# Altium schematic sheet Sheet1.SchDoc (part 1 of 3)
size C; SheetNumber: 1; SheetTotal: 1
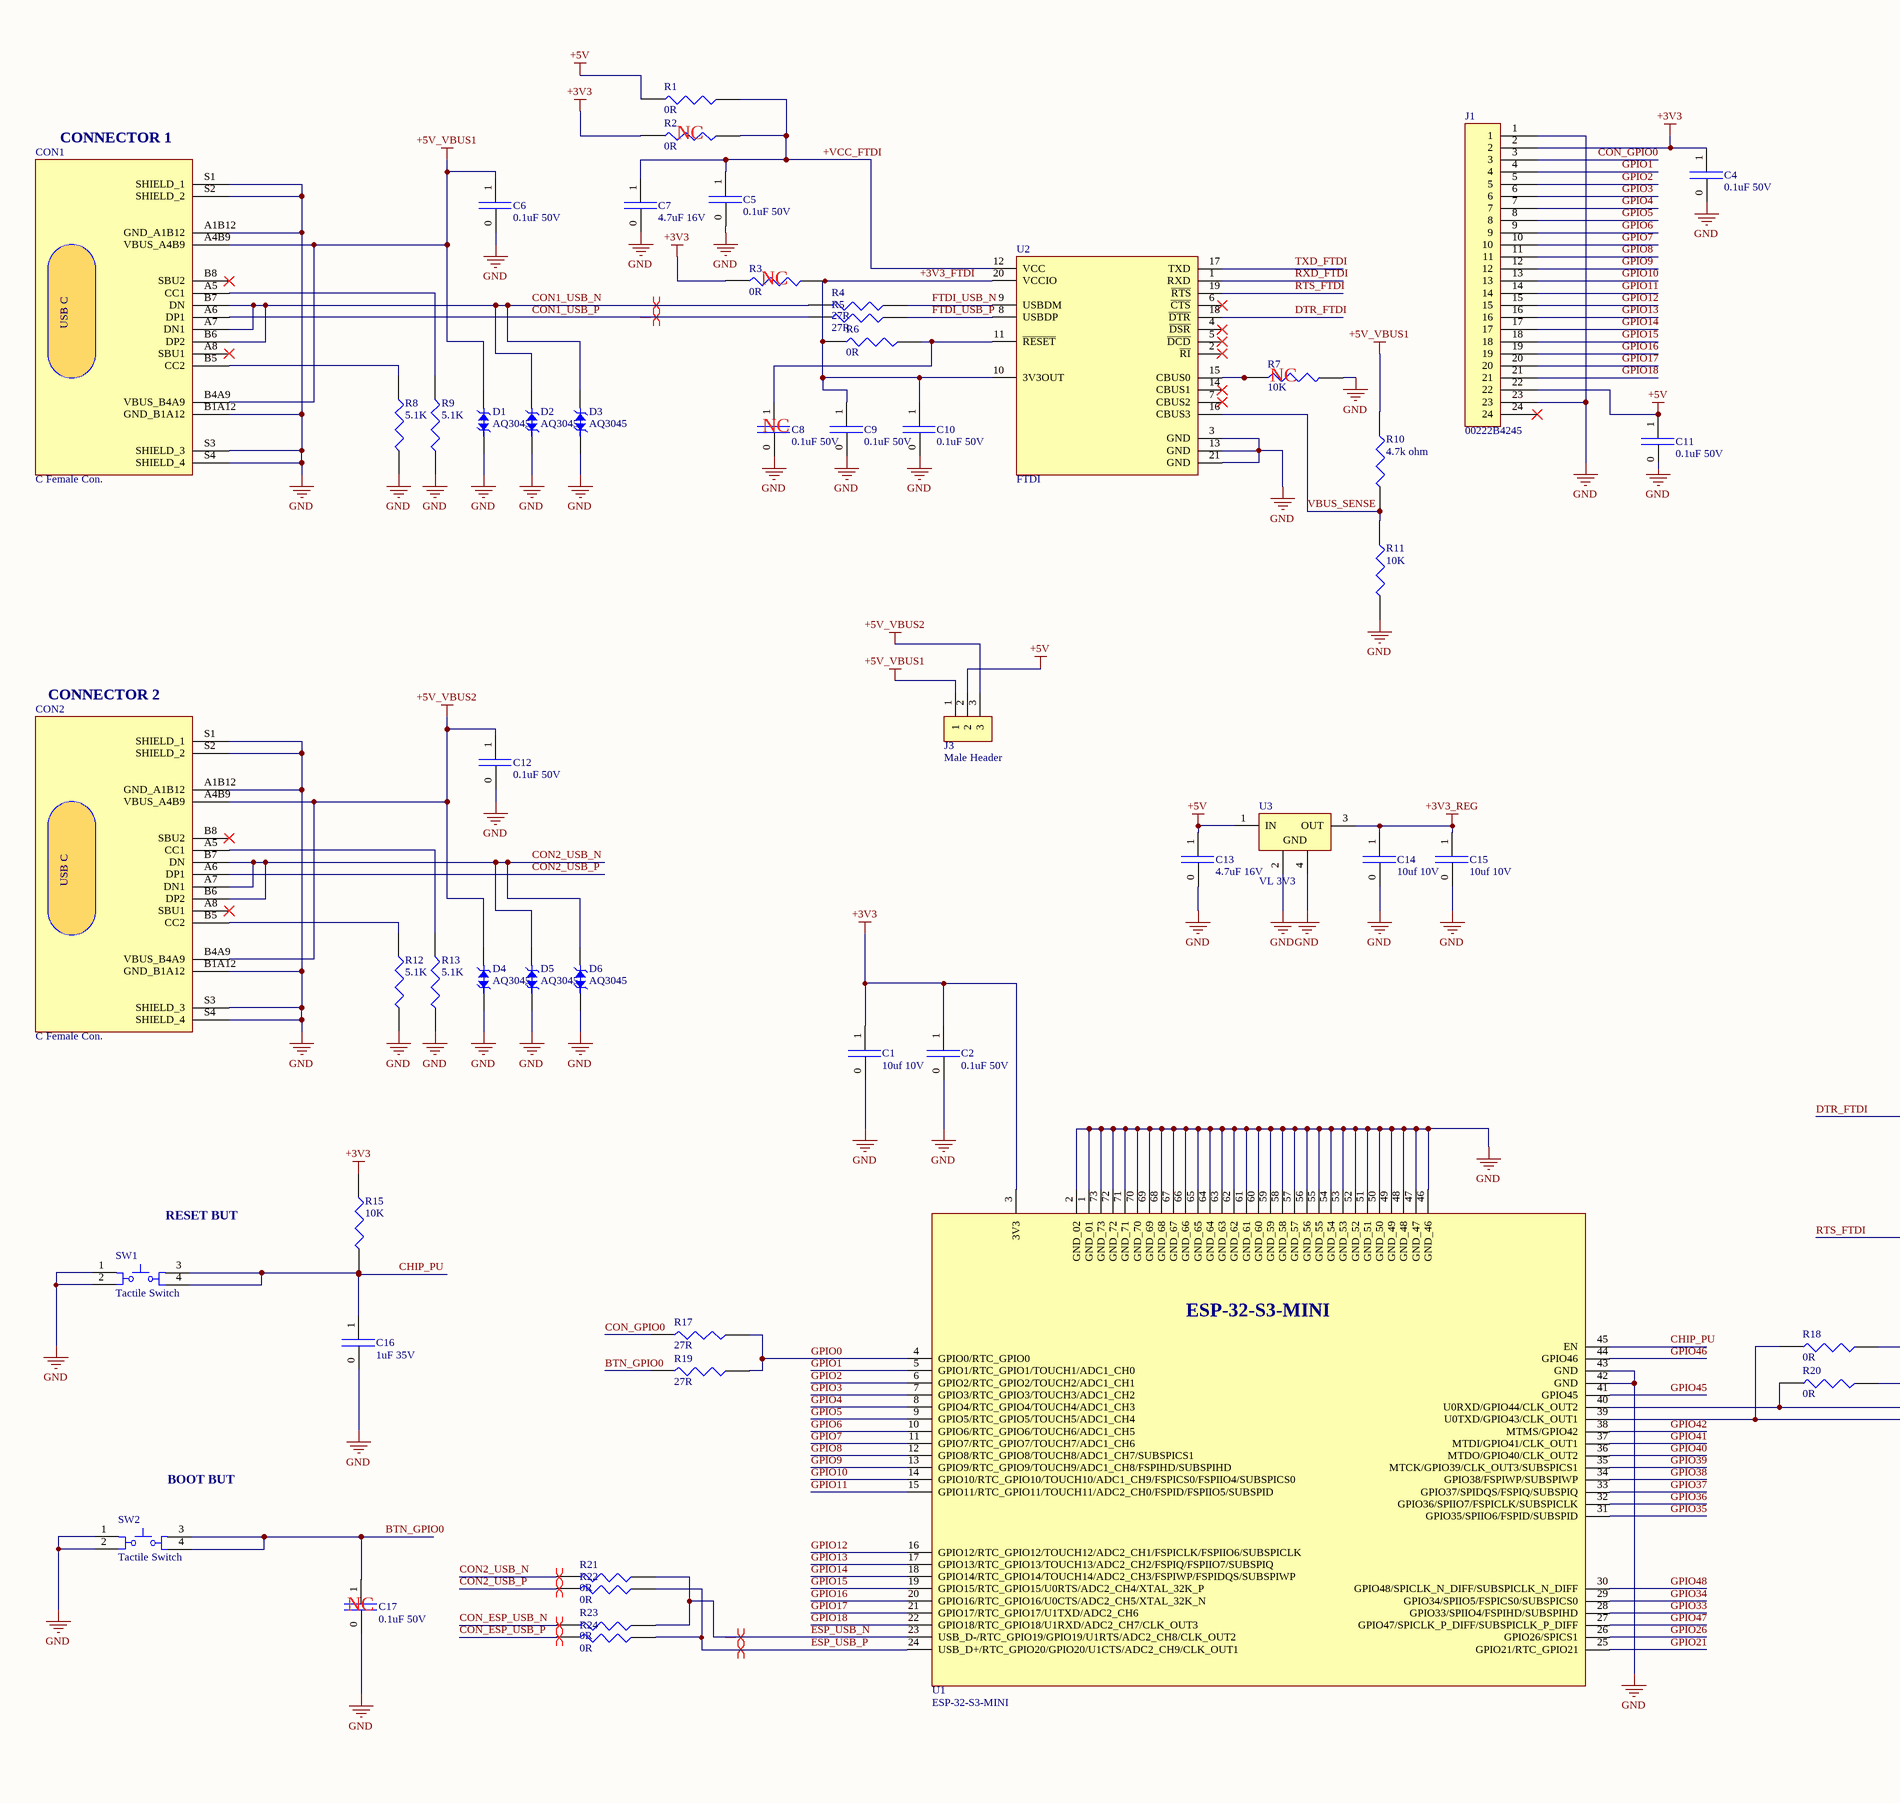
[diagram p0: Sheet1.SchDoc, left]
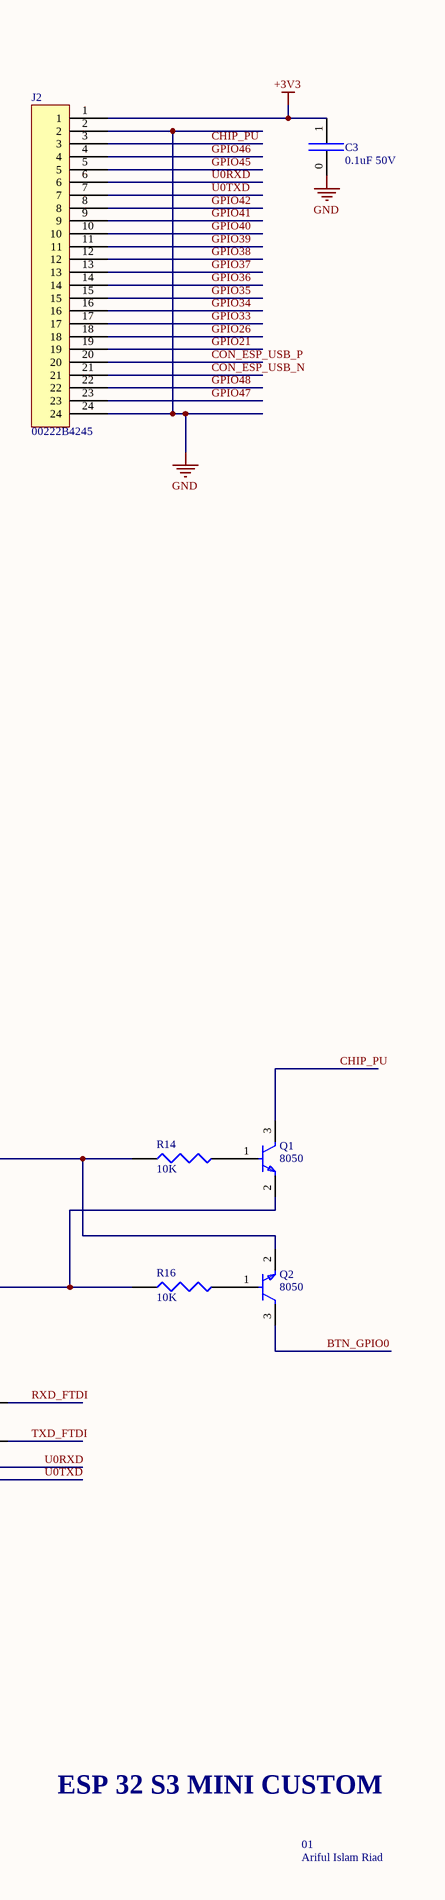
[diagram p1: Sheet1.SchDoc, right]

## Parts
C1  10uf 10V  [CAPC1005X80N]
C2  0.1uF 50V  [CAPC1005X80N]
C3  0.1uF 50V  [CAPC1005X80N]
C4  0.1uF 50V  [CAPC1005X80N]
C5  0.1uF 50V  [CAPC1005X80N]
C6  0.1uF 50V  [CAPC1005X80N]
C7  4.7uF 16V  [CAPC1005X80N]
C8  0.1uF 50V  [CAPC1005X80N]
C9  0.1uF 50V  [CAPC1005X80N]
C10  0.1uF 50V  [CAPC1005X80N]
C11  0.1uF 50V  [CAPC1005X80N]
C12  0.1uF 50V  [CAPC1005X80N]
C13  4.7uF 16V  [CAPC1005X80N]
C14  10uf 10V  [CAPC1005X80N]
C15  10uf 10V  [CAPC1005X80N]
C16  1uF 35V  [CAPC1005X80N]
C17  0.1uF 50V  [CAPC1005X80N]
CON1  C Female Con.  [FP-2171790001-MFG]
CON2  C Female Con.  [FP-2171790001-MFG]
D1  AQ3045  [SOD882]
D2  AQ3045  [SOD882]
D3  AQ3045  [SOD882]
D4  AQ3045  [SOD882]
D5  AQ3045  [SOD882]
D6  AQ3045  [SOD882]
J1  00222B4245  [HDR_1x24]
J2  00222B4245  [HDR_1x24]
J3  Male Header  [HDR_1X3]
Q1  8050  [FP-SS8050-G-IPC_B]
Q2  8050  [FP-SS8050-G-IPC_B]
R1  0R  [RESC1005X40N]
R2  0R  [RESC1005X40N]
R3  0R  [RESC1005X40N]
R4  27R  [RESC1005X40N]
R5  27R  [RESC1005X40N]
R6  0R  [RESC1005X40N]
R7  10K  [RESC1005X40N]
R8  5.1K  [RESC1005X40N]
R9  5.1K  [RESC1005X40N]
R10  4.7k ohm  [RESC1005X40N]
R11  10K  [RESC1005X40N]
R12  5.1K  [RESC1005X40N]
R13  5.1K  [RESC1005X40N]
R14  10K  [RESC1005X40N]
R15  10K  [RESC1005X40N]
R16  10K  [RESC1005X40N]
R17  27R  [RESC1005X40N]
R18  0R  [RESC1005X40N]
R19  27R  [RESC1005X40N]
R20  0R  [RESC1005X40N]
R21  0R  [RESC1005X40N]
R22  0R  [RESC1005X40N]
R23  0R  [RESC1005X40N]
R24  0R  [RESC1005X40N]
SW1  Tactile Switch  [ESWI-TL3301NF160QG_V]
SW2  Tactile Switch  [ESWI-TL3301NF160QG_V]
U1  ESP-32-S3-MINI  [XCVR_ESP32-S3-MINI-1-N8]
U2  FTDI  [FP-QFN-20-IPC_B]
U3  VL 3V3  [DCY0004A_N]

## Nets
+3V3: C1.1 C2.1 C3.1 C4.1 J1.2 J2.1 R2.2 R3.2 R15.3 U1.3(3V3)
+3V3_REG: C14.1 C15.1 U3.3(OUT)
+5V: C11.1 C13.1 J1.22 J3.2 R1.2 U3.1(IN)
+5V_VBUS1: C6.1 CON1.A4B9(VBUS_A4B9) CON1.B4A9(VBUS_B4A9) D1.B10 J3.1 R10.3
+5V_VBUS2: C12.1 CON2.A4B9(VBUS_A4B9) CON2.B4A9(VBUS_B4A9) D4.B10 J3.3
GND: C1.0 C2.0 C3.0 C4.0 C5.0 C6.0 C7.0 C8.0 C9.0 C10.0 C11.0 C12.0 C13.0 C14.0 C15.0 C16.0 C17.0 CON1.A1B12(GND_A1B12) CON1.B1A12(GND_B1A12) CON1.S1(SHIELD_1) CON1.S2(SHIELD_2) CON1.S3(SHIELD_3) CON1.S4(SHIELD_4) CON2.A1B12(GND_A1B12) CON2.B1A12(GND_B1A12) CON2.S1(SHIELD_1) CON2.S2(SHIELD_2) CON2.S3(SHIELD_3) CON2.S4(SHIELD_4) D1.B9 D2.B9 D3.B9 D4.B9 D5.B9 D6.B9 J1.1 J1.23 J2.2 J2.24 R7.2 R8.2 R9.2 R11.2 R12.2 R13.2 SW1.1 SW1.2 SW2.1 SW2.2 U1.1(GND_01) U1.2(GND_02) U1.42(GND) U1.43(GND) U1.46(GND_46) U1.47(GND_47) U1.48(GND_48) U1.49(GND_49) U1.50(GND_50) U1.51(GND_51) U1.52(GND_52) U1.53(GND_53) U1.54(GND_54) U1.55(GND_55) U1.56(GND_56) U1.57(GND_57) U1.58(GND_58) U1.59(GND_59) U1.60(GND_60) U1.61(GND_61) U1.62(GND_62) U1.63(GND_63) U1.64(GND_64) U1.65(GND_65) U1.66(GND_66) U1.67(GND_67) U1.68(GND_68) U1.69(GND_69) U1.70(GND_70) U1.71(GND_71) U1.72(GND_72) U1.73(GND_73) U2.3(GND) U2.13(GND) U2.21(GND) U3.2(GND) U3.4(GND)
+3V3_FTDI: C9.1 C10.1 R3.3 R6.2 U2.10(3V3OUT) U2.20(VCCIO)
+VCC_FTDI: C5.1 C7.1 R1.3 R2.3 U2.12(VCC)
BTN_GPIO0: C17.1 Q2.3(C) R19.2 SW2.3 SW2.4
CHIP_PU: C16.1 J2.3 Q1.3(C) R15.2 SW1.3 SW1.4 U1.45(EN)
CON1_USB_N: CON1.A7(DN1) CON1.B6(DP2) CON1.B7(DN) D2.B10 D3.B10 R4.2
CON1_USB_P: CON1.A6(DP1) R5.2
CON2_USB_N: CON2.A7(DN1) CON2.B6(DP2) CON2.B7(DN) D5.B10 D6.B10 R21.2
CON2_USB_P: CON2.A6(DP1) R22.2
CON_ESP_USB_N: J2.21 R23.2
CON_ESP_USB_P: J2.20 R24.2
CON_GPIO0: J1.3 R17.2
DTR_FTDI: Q2.2(E) R14.3 U2.18(~{DTR})
ESP_USB_N: R21.3 R23.3 U1.23(USB_D-/RTC_GPIO19/GPIO19/U1RTS/ADC2_CH8/CLK_OUT2)
ESP_USB_P: R22.3 R24.3 U1.24(USB_D+/RTC_GPIO20/GPIO20/U1CTS/ADC2_CH9/CLK_OUT1)
FTDI_USB_N: R4.3 U2.9(USBDM)
FTDI_USB_P: R5.3 U2.8(USBDP)
GPIO0: R17.3 R19.3 U1.4(GPIO0/RTC_GPIO0)
GPIO1: J1.4 U1.5(GPIO1/RTC_GPIO1/TOUCH1/ADC1_CH0)
GPIO2: J1.5 U1.6(GPIO2/RTC_GPIO2/TOUCH2/ADC1_CH1)
GPIO3: J1.6 U1.7(GPIO3/RTC_GPIO3/TOUCH3/ADC1_CH2)
GPIO4: J1.7 U1.8(GPIO4/RTC_GPIO4/TOUCH4/ADC1_CH3)
GPIO5: J1.8 U1.9(GPIO5/RTC_GPIO5/TOUCH5/ADC1_CH4)
GPIO6: J1.9 U1.10(GPIO6/RTC_GPIO6/TOUCH6/ADC1_CH5)
GPIO7: J1.10 U1.11(GPIO7/RTC_GPIO7/TOUCH7/ADC1_CH6)
GPIO8: J1.11 U1.12(GPIO8/RTC_GPIO8/TOUCH8/ADC1_CH7/SUBSPICS1)
GPIO9: J1.12 U1.13(GPIO9/RTC_GPIO9/TOUCH9/ADC1_CH8/FSPIHD/SUBSPIHD)
GPIO10: J1.13 U1.14(GPIO10/RTC_GPIO10/TOUCH10/ADC1_CH9/FSPICS0/FSPIIO4/SUBSPICS0)
GPIO11: J1.14 U1.15(GPIO11/RTC_GPIO11/TOUCH11/ADC2_CH0/FSPID/FSPIIO5/SUBSPID)
GPIO12: J1.15 U1.16(GPIO12/RTC_GPIO12/TOUCH12/ADC2_CH1/FSPICLK/FSPIIO6/SUBSPICLK)
GPIO13: J1.16 U1.17(GPIO13/RTC_GPIO13/TOUCH13/ADC2_CH2/FSPIQ/FSPIIO7/SUBSPIQ)
GPIO14: J1.17 U1.18(GPIO14/RTC_GPIO14/TOUCH14/ADC2_CH3/FSPIWP/FSPIDQS/SUBSPIWP)
GPIO15: J1.18 U1.19(GPIO15/RTC_GPIO15/U0RTS/ADC2_CH4/XTAL_32K_P)
GPIO16: J1.19 U1.20(GPIO16/RTC_GPIO16/U0CTS/ADC2_CH5/XTAL_32K_N)
GPIO17: J1.20 U1.21(GPIO17/RTC_GPIO17/U1TXD/ADC2_CH6)
GPIO18: J1.21 U1.22(GPIO18/RTC_GPIO18/U1RXD/ADC2_CH7/CLK_OUT3)
GPIO21: J2.19 U1.25(GPIO21/RTC_GPIO21)
GPIO26: J2.18 U1.26(GPIO26/SPICS1)
GPIO33: J2.17 U1.28(GPIO33/SPIIO4/FSPIHD/SUBSPIHD)
GPIO34: J2.16 U1.29(GPIO34/SPIIO5/FSPICS0/SUBSPICS0)
GPIO35: J2.15 U1.31(GPIO35/SPIIO6/FSPID/SUBSPID)
GPIO36: J2.14 U1.32(GPIO36/SPIIO7/FSPICLK/SUBSPICLK)
GPIO37: J2.13 U1.33(GPIO37/SPIDQS/FSPIQ/SUBSPIQ)
GPIO38: J2.12 U1.34(GPIO38/FSPIWP/SUBSPIWP)
GPIO39: J2.11 U1.35(MTCK/GPIO39/CLK_OUT3/SUBSPICS1)
GPIO40: J2.10 U1.36(MTDO/GPIO40/CLK_OUT2)
GPIO41: J2.9 U1.37(MTDI/GPIO41/CLK_OUT1)
GPIO42: J2.8 U1.38(MTMS/GPIO42)
GPIO45: J2.5 U1.41(GPIO45)
GPIO46: J2.4 U1.44(GPIO46)
GPIO47: J2.23 U1.27(GPIO47/SPICLK_P_DIFF/SUBSPICLK_P_DIFF)
GPIO48: J2.22 U1.30(GPIO48/SPICLK_N_DIFF/SUBSPICLK_N_DIFF)
RTS_FTDI: Q1.2(E) R16.3 U2.19(~{RTS})
RXD_FTDI: R18.3 U2.1(RXD)
TXD_FTDI: R20.3 U2.17(TXD)
U0RXD: J2.6 R20.2 U1.40(U0RXD/GPIO44/CLK_OUT2)
U0TXD: J2.7 R18.2 U1.39(U0TXD/GPIO43/CLK_OUT1)
VBUS_SENSE: R10.2 R11.3 U2.16(CBUS3)
NetC8_1: C8.1 R6.3 U2.11(~{RESET})
NetCON1_A5: CON1.A5(CC1) R9.3
NetCON1_B5: CON1.B5(CC2) R8.3
NetCON2_A5: CON2.A5(CC1) R13.3
NetCON2_B5: CON2.B5(CC2) R12.3
NetQ1_1: Q1.1(B) R14.2
NetQ2_1: Q2.1(B) R16.2
NetR7_3: R7.3 U2.15(CBUS0)

Not connected (* = marked no-connect by the designer): CON1 A8(SBU1)* B8(SBU2)*; CON2 A8(SBU1)* B8(SBU2)*; J1 24*; U2 2(~{RI})* 4(~{DSR})* 5(~{DCD})* 6(~{CTS})* 7(CBUS2)* 14(CBUS1)*

## Layout directives
differential pair; differential pair class DIFF90: CON1_USB_N, CON1_USB_P, CON2_USB_N, CON2_USB_P, CON_ESP_USB_N, CON_ESP_USB_P, ESP_USB_N, ESP_USB_P

## Notes on the sheet
- CONNECTOR 1
- (near R2) NC
- (near R3) NC
- (near R7) NC
- (near C8) NC
- CONNECTOR 2
- RESET BUT
- BOOT BUT
- (near C17) NC
- ESP 32 S3 MINI CUSTOM
- Ariful Islam Riad
- 01
- (in symbol 217179-0001) USB C